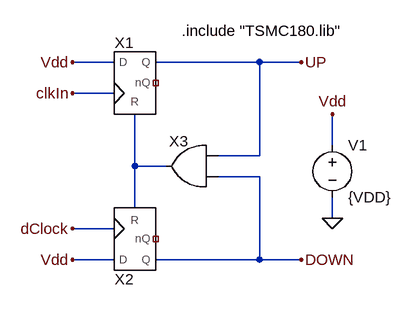
[diagram p0: schematic pfd.asc]
pfd.asc, the LTspice schematic file:
Version 4
SHEET 1 1644 684
WIRE 912 256 848 256
WIRE 1136 256 976 256
WIRE 1200 256 1136 256
WIRE 912 304 848 304
WIRE 1248 384 1248 336
WIRE 1136 400 1136 256
WIRE 1136 400 1072 400
WIRE 944 416 944 336
WIRE 992 416 944 416
WIRE 1136 432 1072 432
WIRE 944 480 944 416
WIRE 1248 496 1248 464
WIRE 912 512 848 512
WIRE 912 560 848 560
WIRE 1136 560 1136 432
WIRE 1136 560 976 560
WIRE 1200 560 1136 560
FLAG 848 256 Vdd
FLAG 848 304 clkIn
FLAG 848 512 dClock
FLAG 848 560 Vdd
FLAG 1200 256 UP
FLAG 1200 560 DOWN
FLAG 1248 336 Vdd
FLAG 1248 496 0
SYMBOL ffd_arst 944 288 R0
SYMATTR InstName X1
SYMATTR SpiceLine VDD={VDD} L={L} LD={LD} WN={WN} WPFACT=1.5
SYMBOL ffd_arst 944 528 M180
SYMATTR InstName X2
SYMATTR SpiceLine VDD={VDD} L={L} LD={LD} WN={WN} WPFACT=1.5
SYMBOL and 1024 480 R180
WINDOW 0 -2 102 Left 2
SYMATTR InstName X3
SYMATTR SpiceLine VDD={VDD} L={L} LD={LD} WN={WN} WPFACT=1.5
SYMBOL voltage 1248 368 R0
WINDOW 123 0 0 Left 0
WINDOW 39 0 0 Left 0
SYMATTR InstName V1
SYMATTR Value {VDD}
TEXT 1016 208 Left 2 !.include "TSMC180.lib"

The netlist it stands for:
* pfd.asc
XX1 Vdd UP clkIn N001 NC_01 ffd_arst VDD={VDD} L={L} LD={LD} WN={WN} WPFACT=1.5  ; pins D Q CLK R nQ
XX2 Vdd DOWN dClock N001 NC_02 ffd_arst VDD={VDD} L={L} LD={LD} WN={WN} WPFACT=1.5  ; pins D Q CLK R nQ
XX3 DOWN UP N001 and VDD={VDD} L={L} LD={LD} WN={WN} WPFACT=1.5  ; pins A B OUT
V1 Vdd 0 {VDD}
.include "TSMC180.lib"
.backanno
.end